# EAGLE schematic schematic (EAGLE 9.6.2)
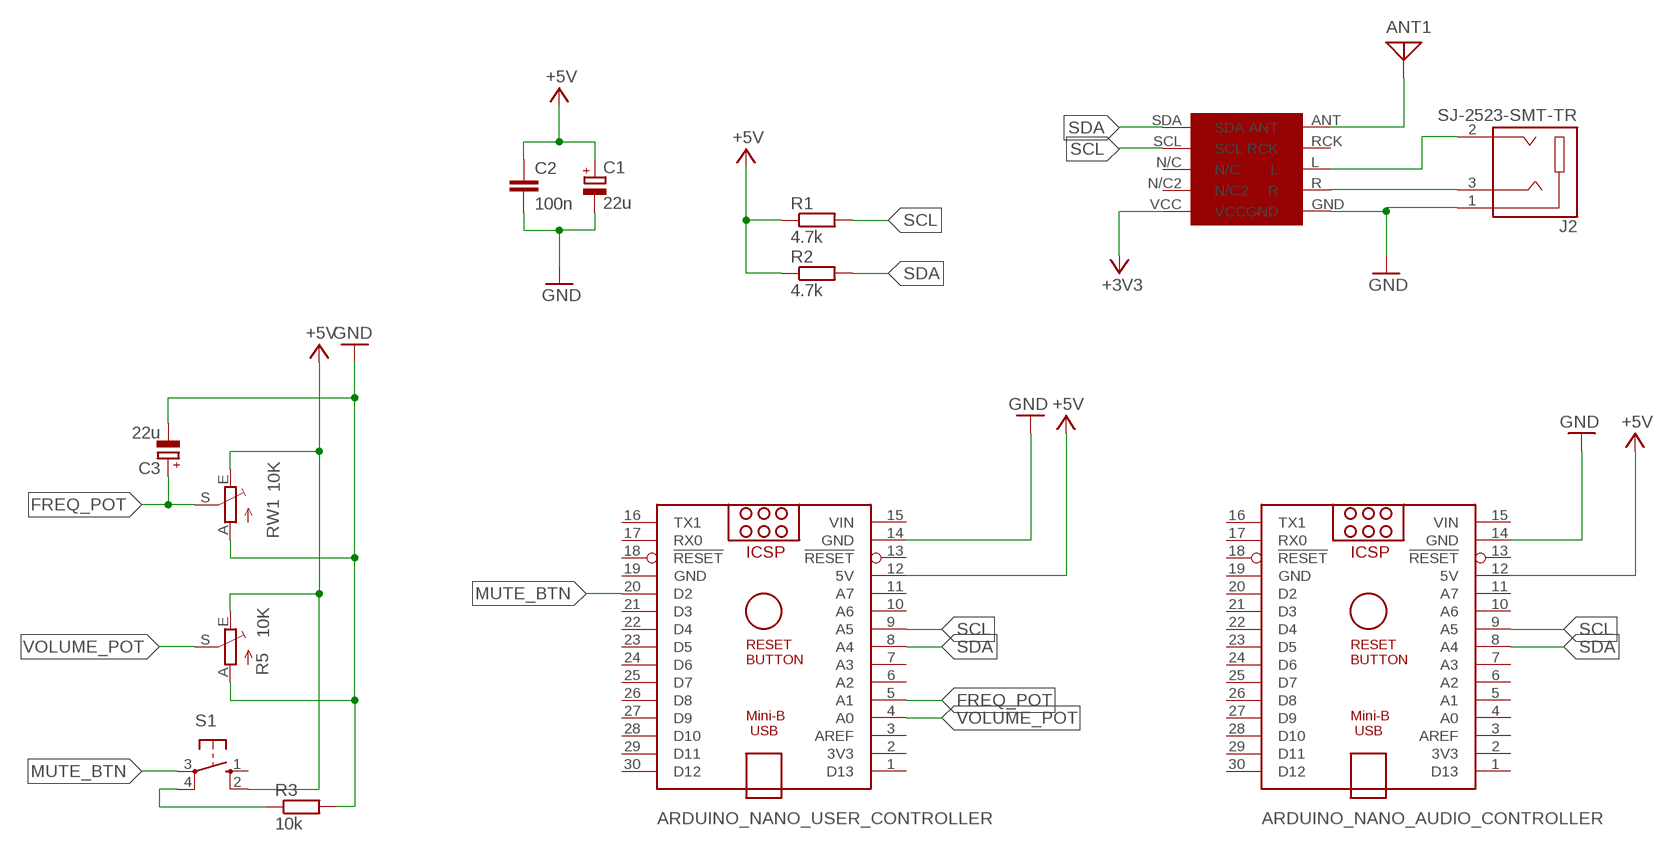
[diagram p0: schematic, sheet 1]

## Parts
ANT1  ANTENNA  [PAD-01]
ARDUINO_NANO_AUDIO_CONTROLLER  ARDUINO_NANO  [ARDUINO_NANO]
ARDUINO_NANO_USER_CONTROLLER  ARDUINO_NANO  [ARDUINO_NANO]
C1  22u  CPOL-EUE2,5-6E  [E2,5-6E]
C2  100n  C-EU025-024X044  [C025-024X044]
C3  22u  CPOL-EUE2,5-6E  [E2,5-6E]
J2  SJ-2523-SMT-TR  [SJ-2523-SMT-TR]
R1  4.7k  R-EU_0204/7  [0204/7]
R2  4.7k  R-EU_0204/7  [0204/7]
R3  10k  R-EU_0204/7  [0204/7]
R5  10K  TRIM_EU-B25V  [B25V]
RW1  10K  TRIM_EU-B25V  [B25V]
S1  10-XX  [B3F-10XX]
U$1  RDA  [RDA]

## Nets
+3V3: U$1.VCC
+5V: ARDUINO_NANO_AUDIO_CONTROLLER.12(5V) ARDUINO_NANO_USER_CONTROLLER.12(5V) C1.+ C2.1 R1.1 R2.1 R5.E RW1.E S1.1(S)
FREQ_POT: ARDUINO_NANO_USER_CONTROLLER.5(A1) C3.+ RW1.S
GND: ARDUINO_NANO_AUDIO_CONTROLLER.14(GND) ARDUINO_NANO_USER_CONTROLLER.14(GND) C1.- C2.2 C3.- J2.1(SLEEVE) R3.2 R5.A RW1.A U$1.GND
MUTE_BTN: ARDUINO_NANO_USER_CONTROLLER.20(D2) ARDUINO_NANO_USER_CONTROLLER.30(D12) R3.1 S1.2(S1) S1.3(P) S1.4(P1)
N$1: ANT1.1 U$1.ANT
N$2: J2.2(TIP) U$1.L
N$3: J2.3(RING) U$1.R
SCL: ARDUINO_NANO_AUDIO_CONTROLLER.9(A5) ARDUINO_NANO_USER_CONTROLLER.9(A5) R1.2 U$1.SCL
SDA: ARDUINO_NANO_AUDIO_CONTROLLER.8(A4) ARDUINO_NANO_USER_CONTROLLER.8(A4) R2.2 U$1.SDA
VOLUME_POT: ARDUINO_NANO_USER_CONTROLLER.4(A0) R5.S
Unconnected: ARDUINO_NANO_AUDIO_CONTROLLER.1(D13) ARDUINO_NANO_AUDIO_CONTROLLER.2(3V3) ARDUINO_NANO_AUDIO_CONTROLLER.3(AREF) ARDUINO_NANO_AUDIO_CONTROLLER.4(A0) ARDUINO_NANO_AUDIO_CONTROLLER.5(A1) ARDUINO_NANO_AUDIO_CONTROLLER.6(A2) ARDUINO_NANO_AUDIO_CONTROLLER.7(A3) ARDUINO_NANO_AUDIO_CONTROLLER.10(A6) ARDUINO_NANO_AUDIO_CONTROLLER.11(A7) ARDUINO_NANO_AUDIO_CONTROLLER.13(!RESET) ARDUINO_NANO_AUDIO_CONTROLLER.16(TX1) ARDUINO_NANO_AUDIO_CONTROLLER.17(RX0) ARDUINO_NANO_AUDIO_CONTROLLER.18(!RESET) ARDUINO_NANO_AUDIO_CONTROLLER.20(D2) ARDUINO_NANO_AUDIO_CONTROLLER.21(D3) ARDUINO_NANO_AUDIO_CONTROLLER.22(D4) ARDUINO_NANO_AUDIO_CONTROLLER.23(D5) ARDUINO_NANO_AUDIO_CONTROLLER.24(D6) ARDUINO_NANO_AUDIO_CONTROLLER.25(D7) ARDUINO_NANO_AUDIO_CONTROLLER.26(D8) ARDUINO_NANO_AUDIO_CONTROLLER.27(D9) ARDUINO_NANO_AUDIO_CONTROLLER.28(D10) ARDUINO_NANO_AUDIO_CONTROLLER.29(D11) ARDUINO_NANO_AUDIO_CONTROLLER.30(D12) ARDUINO_NANO_USER_CONTROLLER.1(D13) ARDUINO_NANO_USER_CONTROLLER.2(3V3) ARDUINO_NANO_USER_CONTROLLER.3(AREF) ARDUINO_NANO_USER_CONTROLLER.6(A2) ARDUINO_NANO_USER_CONTROLLER.7(A3) ARDUINO_NANO_USER_CONTROLLER.10(A6) ARDUINO_NANO_USER_CONTROLLER.11(A7) ARDUINO_NANO_USER_CONTROLLER.13(!RESET) ARDUINO_NANO_USER_CONTROLLER.16(TX1) ARDUINO_NANO_USER_CONTROLLER.17(RX0) ARDUINO_NANO_USER_CONTROLLER.18(!RESET) ARDUINO_NANO_USER_CONTROLLER.21(D3) ARDUINO_NANO_USER_CONTROLLER.22(D4) ARDUINO_NANO_USER_CONTROLLER.23(D5) ARDUINO_NANO_USER_CONTROLLER.24(D6) ARDUINO_NANO_USER_CONTROLLER.25(D7) ARDUINO_NANO_USER_CONTROLLER.26(D8) ARDUINO_NANO_USER_CONTROLLER.27(D9) ARDUINO_NANO_USER_CONTROLLER.28(D10) ARDUINO_NANO_USER_CONTROLLER.29(D11) U$1.N/C U$1.N/C2 U$1.RCK

## Power pins joined to a net without a drawn wire
GND: ARDUINO_NANO_AUDIO_CONTROLLER.19(GND) ARDUINO_NANO_USER_CONTROLLER.19(GND)
VIN: ARDUINO_NANO_AUDIO_CONTROLLER.15(VIN) ARDUINO_NANO_USER_CONTROLLER.15(VIN)

## Library data of the parts
ANT1 = discrete:ANTENNA: Antenna
ARDUINO_NANO_AUDIO_CONTROLLER ARDUINO_NANO_USER_CONTROLLER = ArduinoNanoV30:ARDUINO_NANO: Arduino Nano V3.0 Overview: The Arduino Nano is a small, complete, and breadboard-friendly board based on the ATmega328 (Arduino Nano 3.x) or ATmega168 (Arduino Nano 2.x). It has more or less the same functionality of the Arduino Duemilanove, but in a different package. It lacks only a DC power jack, and works with a Mini-B USB cable instead of a standard one. The Nano was designed and is being produced by Gravitech. Specifications: Microcontroller Atmel ATmega168 or ATmega328 Operating Voltage (logic level) 5 V Input Voltage (recommended) 7-12 V Input Voltage (limits) 6-20 V Digital I/O Pins 14 (of which 6 provide PWM output) Analog Input Pins 8 DC Current per I/O Pin 40 mA Flash Memory 16 KB (ATmega168) or 32 KB (ATmega328) of which 2 KB used by bootloader SRAM 1 KB (ATmega168) or 2 KB (ATmega328) EEPROM 512 bytes (ATmega168) or 1 KB (ATmega328) Clock Speed 16 MHz Dimensions 0.73" x 1.70" Length 45 mm Width 18 mm Weigth 5 g Power: The Arduino Nano can be powered via the Mini-B USB connection, 6-20V unregulated external power supply (pin 30), or 5V regulated external power supply (pin 27). The power source is automatically selected to the highest voltage source. Memory: The ATmega168 has 16 KB of flash memory for storing code (of which 2 KB is used for the bootloader); the ATmega328 has 32 KB, (also with 2 KB used for the bootloader). The ATmega168 has 1 KB of SRAM and 512 bytes of EEPROM (which can be read and written with the EEPROM library); the ATmega328 has 2 KB of SRAM and 1 KB of EEPROM. Input and Output: Each of the 14 digital pins on the Nano can be used as an input or output, using pinMode(), digitalWrite(), and digitalRead() functions. They operate at 5 volts. Each pin can provide or receive a maximum of 40 mA and has an internal pull-up resistor (disconnected by default) of 20-50 kOhms. In addition, some pins have specialized functions. Visit Arduino - ArduinoBoardNano <https://www.arduino.cc/en/Main/ArduinoBoardNano>
C1 C3 = rcl:CPOL-EU: POLARIZED CAPACITOR, European symbol; SPICEPREFIX: C
C2 = rcl:C-EU: CAPACITOR, European symbol; SPICEPREFIX: C
J2 = Audio Connectors:SJ-2523-SMT-TR: CONN JACK STEREO 2.5MM SMD R/A Manufacturer's datasheet <https://www.cuidevices.com/product/resource/sj-252x-smt.pdf>; CREATED_BY: PCBLayout.com; DIGIKEY_PN: CP-2523SJTR-ND; MANUFACTURER: CUI Devices; MPN: SJ-2523-SMT-TR
R1-R3 = rcl:R-EU_: RESISTOR, European symbol; SPICEPREFIX: R
R5 RW1 = pot:TRIM_EU-: POTENTIOMETER
S1 = switch-omron:10-XX: OMRON SWITCH; MPN: B3F-1000; OC_FARNELL: 176432; OC_NEWARK: 36M3542
U$1 = RDA:RDA